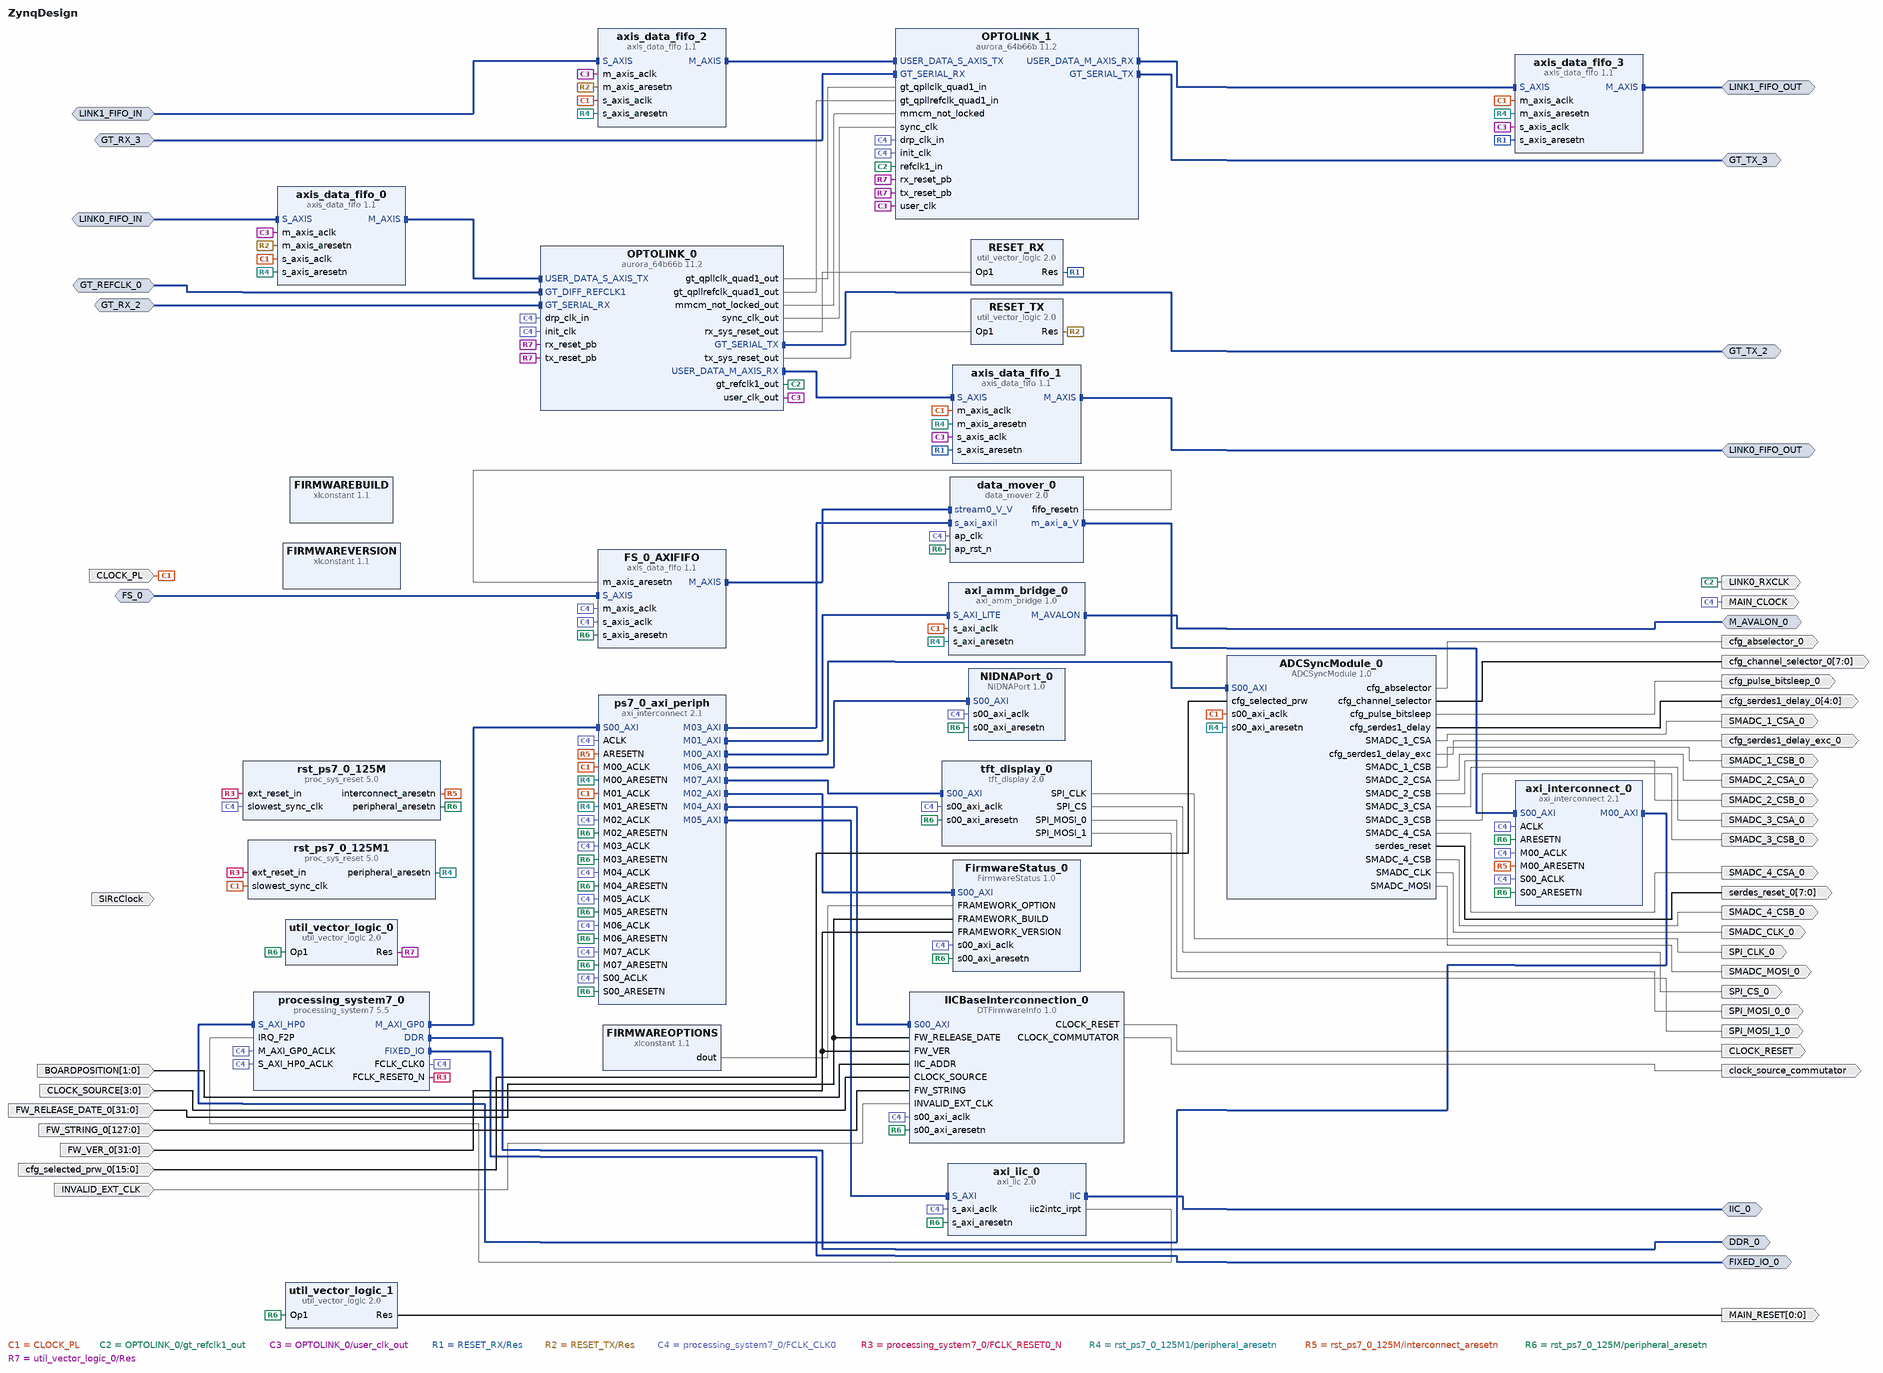
[diagram p0: block diagram of the top level]
# Vivado block design ZynqDesign, xc7z030fbg676-2, Vivado 2017.4
create_bd_design ZynqDesign

create_bd_intf_port -mode Master -vlnv xilinx.com:interface:ddrx_rtl:1.0 DDR_0
create_bd_intf_port -mode Master -vlnv xilinx.com:display_processing_system7:fixedio_rtl:1.0 FIXED_IO_0
create_bd_intf_port -mode Slave -vlnv xilinx.com:interface:axis_rtl:1.0 FS_0
set_property -dict [list \
  CONFIG.TDATA_NUM_BYTES 8 \
  CONFIG.TDEST_WIDTH 0 \
  CONFIG.TID_WIDTH 0 \
  CONFIG.TUSER_WIDTH 0 \
  CONFIG.HAS_TREADY 1 \
  CONFIG.HAS_TSTRB 0 \
  CONFIG.HAS_TKEEP 0 \
  CONFIG.HAS_TLAST 0 \
  CONFIG.FREQ_HZ 125000000 \
  CONFIG.LAYERED_METADATA {xilinx.com:interface:datatypes:1.0 {TDATA {datatype {name {attribs {resolve_type immediate dependency {} format string minimum {} maximum {}} value {}} bitwidth {attribs {resolve_type immediate dependency {} format long minimum {} maximum {}} value 64} bitoffset {attribs {resolve_type immediate dependency {} format long minimum {} maximum {}} value 0} integer {signed {attribs {resolve_type immediate dependency {} format bool minimum {} maximum {}} value false}}}}}} \
] [get_bd_intf_ports FS_0]
create_bd_intf_port -mode Slave -vlnv xilinx.com:interface:diff_clock_rtl:1.0 GT_REFCLK_0
set_property -dict {CONFIG.FREQ_HZ 156250000} [get_bd_intf_ports GT_REFCLK_0]
create_bd_intf_port -mode Slave -vlnv xilinx.com:display_aurora:GT_Serial_Transceiver_Pins_RX_rtl:1.0 GT_RX_2
create_bd_intf_port -mode Slave -vlnv xilinx.com:display_aurora:GT_Serial_Transceiver_Pins_RX_rtl:1.0 GT_RX_3
create_bd_intf_port -mode Master -vlnv xilinx.com:display_aurora:GT_Serial_Transceiver_Pins_TX_rtl:1.0 GT_TX_2
create_bd_intf_port -mode Master -vlnv xilinx.com:display_aurora:GT_Serial_Transceiver_Pins_TX_rtl:1.0 GT_TX_3
create_bd_intf_port -mode Master -vlnv xilinx.com:interface:iic_rtl:1.0 IIC_0
create_bd_intf_port -mode Slave -vlnv xilinx.com:interface:axis_rtl:1.0 LINK0_FIFO_IN
set_property -dict [list \
  CONFIG.TDATA_NUM_BYTES 1 \
  CONFIG.TDEST_WIDTH 0 \
  CONFIG.TID_WIDTH 0 \
  CONFIG.TUSER_WIDTH 0 \
  CONFIG.HAS_TREADY 1 \
  CONFIG.HAS_TSTRB 0 \
  CONFIG.HAS_TKEEP 0 \
  CONFIG.HAS_TLAST 0 \
  CONFIG.FREQ_HZ 125000000 \
  CONFIG.LAYERED_METADATA undef \
] [get_bd_intf_ports LINK0_FIFO_IN]
create_bd_intf_port -mode Master -vlnv xilinx.com:interface:axis_rtl:1.0 LINK0_FIFO_OUT
set_property -dict {CONFIG.FREQ_HZ 125000000} [get_bd_intf_ports LINK0_FIFO_OUT]
create_bd_intf_port -mode Slave -vlnv xilinx.com:interface:axis_rtl:1.0 LINK1_FIFO_IN
set_property -dict [list \
  CONFIG.TDATA_NUM_BYTES 1 \
  CONFIG.TDEST_WIDTH 0 \
  CONFIG.TID_WIDTH 0 \
  CONFIG.TUSER_WIDTH 0 \
  CONFIG.HAS_TREADY 1 \
  CONFIG.HAS_TSTRB 0 \
  CONFIG.HAS_TKEEP 0 \
  CONFIG.HAS_TLAST 0 \
  CONFIG.FREQ_HZ 125000000 \
  CONFIG.LAYERED_METADATA undef \
] [get_bd_intf_ports LINK1_FIFO_IN]
create_bd_intf_port -mode Master -vlnv xilinx.com:interface:axis_rtl:1.0 LINK1_FIFO_OUT
set_property -dict {CONFIG.FREQ_HZ 125000000} [get_bd_intf_ports LINK1_FIFO_OUT]
create_bd_intf_port -mode Master -vlnv xilinx.com:interface:avalon_rtl:1.0 M_AVALON_0
create_bd_port -dir I -from 1 -to 0 BOARDPOSITION
create_bd_port -dir I -type clk CLOCK_PL
set_property -dict [list \
  CONFIG.FREQ_HZ 125000000 \
  CONFIG.ASSOCIATED_BUSIF LINK0_FIFO_IN:LINK1_FIFO_IN:LINK1_FIFO_OUT:LINK0_FIFO_OUT \
] [get_bd_ports CLOCK_PL]
create_bd_port -dir O -type clk CLOCK_RESET
create_bd_port -dir I -from 3 -to 0 CLOCK_SOURCE
create_bd_port -dir I -from 31 -to 0 FW_RELEASE_DATE_0
create_bd_port -dir I -from 127 -to 0 FW_STRING_0
create_bd_port -dir I -from 31 -to 0 FW_VER_0
create_bd_port -dir I -type clk INVALID_EXT_CLK
set_property -dict {CONFIG.FREQ_HZ 125000000} [get_bd_ports INVALID_EXT_CLK]
create_bd_port -dir O -type clk LINK0_RXCLK
create_bd_port -dir O -type clk MAIN_CLOCK
create_bd_port -dir O -from 0 -to 0 MAIN_RESET
create_bd_port -dir I -type clk SIRcClock
set_property -dict {CONFIG.FREQ_HZ 156250000} [get_bd_ports SIRcClock]
create_bd_port -dir O SMADC_1_CSA_0
create_bd_port -dir O SMADC_1_CSB_0
create_bd_port -dir O SMADC_2_CSA_0
create_bd_port -dir O SMADC_2_CSB_0
create_bd_port -dir O SMADC_3_CSA_0
create_bd_port -dir O SMADC_3_CSB_0
create_bd_port -dir O SMADC_4_CSA_0
create_bd_port -dir O SMADC_4_CSB_0
create_bd_port -dir O -type clk SMADC_CLK_0
create_bd_port -dir O SMADC_MOSI_0
create_bd_port -dir O SPI_CLK_0
create_bd_port -dir O SPI_CS_0
create_bd_port -dir O SPI_MOSI_0_0
create_bd_port -dir O SPI_MOSI_1_0
create_bd_port -dir O cfg_abselector_0
create_bd_port -dir O -from 7 -to 0 cfg_channel_selector_0
create_bd_port -dir O cfg_pulse_bitsleep_0
create_bd_port -dir I -from 15 -to 0 cfg_selected_prw_0
create_bd_port -dir O -from 4 -to 0 cfg_serdes1_delay_0
create_bd_port -dir O cfg_serdes1_delay_exc_0
create_bd_port -dir O -type clk clock_source_commutator
create_bd_port -dir O -from 7 -to 0 -type rst serdes_reset_0

create_bd_cell -type ip -vlnv NuclearInstruments:user:ADCSyncModule:1.0 ADCSyncModule_0
create_bd_cell -type ip -vlnv xilinx.com:ip:xlconstant:1.1 FIRMWAREBUILD
set_property -dict {CONFIG.CONST_WIDTH 32 CONFIG.CONST_VAL 0x19031100} [get_bd_cells FIRMWAREBUILD]
create_bd_cell -type ip -vlnv xilinx.com:ip:xlconstant:1.1 FIRMWAREOPTIONS
set_property -dict {CONFIG.CONST_WIDTH 32} [get_bd_cells FIRMWAREOPTIONS]
create_bd_cell -type ip -vlnv xilinx.com:ip:xlconstant:1.1 FIRMWAREVERSION
set_property -dict {CONFIG.CONST_WIDTH 32} [get_bd_cells FIRMWAREVERSION]
create_bd_cell -type ip -vlnv xilinx.com:ip:axis_data_fifo:1.1 FS_0_AXIFIFO
set_property -dict {CONFIG.IS_ACLK_ASYNC 1} [get_bd_cells FS_0_AXIFIFO]
create_bd_cell -type ip -vlnv xilinx.com:user:FirmwareStatus:1.0 FirmwareStatus_0
create_bd_cell -type ip -vlnv NuclearInstruments:user:DTFirmwareInfo:1.0 IICBaseInterconnection_0
create_bd_cell -type ip -vlnv xilinx.com:user:NIDNAPort:1.0 NIDNAPort_0
create_bd_cell -type ip -vlnv xilinx.com:ip:aurora_64b66b:11.2 OPTOLINK_0
set_property -dict [list \
  CONFIG.C_LINE_RATE 6.25 \
  CONFIG.C_REFCLK_FREQUENCY 156.250 \
  CONFIG.dataflow_config TX/RX_Simplex \
  CONFIG.interface_mode Streaming \
  CONFIG.flow_mode None \
  CONFIG.C_USER_K false \
  CONFIG.SINGLEEND_INITCLK true \
  CONFIG.C_GT_LOC_3 X \
  CONFIG.C_GT_LOC_2 X \
  CONFIG.C_GT_LOC_1 1 \
  CONFIG.C_GT_CLOCK_1 GTXQ0 \
  CONFIG.drp_mode Disabled \
  CONFIG.SupportLevel 1 \
  CONFIG.TransceiverControl true \
  CONFIG.C_USE_BYTESWAP false \
] [get_bd_cells OPTOLINK_0]
create_bd_cell -type ip -vlnv xilinx.com:ip:aurora_64b66b:11.2 OPTOLINK_1
set_property -dict [list \
  CONFIG.C_LINE_RATE 6.25 \
  CONFIG.C_REFCLK_FREQUENCY 156.250 \
  CONFIG.dataflow_config TX/RX_Simplex \
  CONFIG.interface_mode Streaming \
  CONFIG.flow_mode None \
  CONFIG.C_USER_K false \
  CONFIG.C_GT_LOC_4 X \
  CONFIG.C_GT_LOC_2 X \
  CONFIG.C_GT_LOC_1 1 \
  CONFIG.C_GT_CLOCK_1 GTXQ0 \
  CONFIG.drp_mode Disabled \
  CONFIG.SupportLevel 0 \
  CONFIG.TransceiverControl true \
] [get_bd_cells OPTOLINK_1]
create_bd_cell -type ip -vlnv xilinx.com:ip:util_vector_logic:2.0 RESET_RX
set_property -dict {CONFIG.C_SIZE 1 CONFIG.C_OPERATION not} [get_bd_cells RESET_RX]
create_bd_cell -type ip -vlnv xilinx.com:ip:util_vector_logic:2.0 RESET_TX
set_property -dict {CONFIG.C_SIZE 1 CONFIG.C_OPERATION not} [get_bd_cells RESET_TX]
create_bd_cell -type ip -vlnv xilinx.com:ip:axi_amm_bridge:1.0 axi_amm_bridge_0
set_property -dict [list \
  CONFIG.C_PROTOCOL 0 \
  CONFIG.C_HAS_WAIT_REQUEST 1 \
  CONFIG.C_BURST_SUPPORT 0 \
  CONFIG.C_ADDRESS_MODE 1 \
  CONFIG.C_USE_BYTEENABLE 0 \
  CONFIG.C_AVM_BURST_WIDTH 1 \
  CONFIG.C_HAS_RESPONSE 0 \
] [get_bd_cells axi_amm_bridge_0]
create_bd_cell -type ip -vlnv xilinx.com:ip:axi_iic:2.0 axi_iic_0
set_property -dict {CONFIG.C_SCL_INERTIAL_DELAY 5 CONFIG.C_SDA_INERTIAL_DELAY 5 CONFIG.IIC_FREQ_KHZ 100} [get_bd_cells axi_iic_0]
create_bd_cell -type ip -vlnv xilinx.com:ip:axi_interconnect:2.1 axi_interconnect_0
set_property -dict {CONFIG.NUM_MI 1} [get_bd_cells axi_interconnect_0]
create_bd_cell -type ip -vlnv xilinx.com:ip:axis_data_fifo:1.1 axis_data_fifo_0
set_property -dict {CONFIG.TDATA_NUM_BYTES 8 CONFIG.IS_ACLK_ASYNC 1} [get_bd_cells axis_data_fifo_0]
create_bd_cell -type ip -vlnv xilinx.com:ip:axis_data_fifo:1.1 axis_data_fifo_1
set_property -dict {CONFIG.IS_ACLK_ASYNC 1} [get_bd_cells axis_data_fifo_1]
create_bd_cell -type ip -vlnv xilinx.com:ip:axis_data_fifo:1.1 axis_data_fifo_2
set_property -dict {CONFIG.TDATA_NUM_BYTES 8 CONFIG.IS_ACLK_ASYNC 1} [get_bd_cells axis_data_fifo_2]
create_bd_cell -type ip -vlnv xilinx.com:ip:axis_data_fifo:1.1 axis_data_fifo_3
set_property -dict {CONFIG.IS_ACLK_ASYNC 1} [get_bd_cells axis_data_fifo_3]
create_bd_cell -type ip -vlnv NuclearInstruments:hls:data_mover:2.0 data_mover_0
create_bd_cell -type ip -vlnv xilinx.com:ip:processing_system7:5.5 processing_system7_0
set_property -dict [list \
  CONFIG.PCW_UIPARAM_DDR_FREQ_MHZ 533.333333 \
  CONFIG.PCW_CPU_CPU_6X4X_MAX_RANGE 800 \
  CONFIG.PCW_APU_PERIPHERAL_FREQMHZ 666.666666 \
  CONFIG.PCW_SDIO_PERIPHERAL_FREQMHZ 50 \
  CONFIG.PCW_UART_PERIPHERAL_FREQMHZ 50 \
  CONFIG.PCW_I2C_PERIPHERAL_FREQMHZ 111.111115 \
  CONFIG.PCW_FPGA0_PERIPHERAL_FREQMHZ 125 \
  CONFIG.PCW_FPGA1_PERIPHERAL_FREQMHZ 100 \
  CONFIG.PCW_FPGA2_PERIPHERAL_FREQMHZ 33.333333 \
  CONFIG.PCW_USE_S_AXI_HP0 1 \
  CONFIG.PCW_USE_FABRIC_INTERRUPT 1 \
  CONFIG.PCW_IRQ_F2P_INTR 1 \
  CONFIG.PCW_GP0_EN_MODIFIABLE_TXN 0 \
  CONFIG.PCW_GP1_EN_MODIFIABLE_TXN 0 \
  CONFIG.PCW_PERIPHERAL_BOARD_PRESET None \
  CONFIG.PCW_PRESET_BANK1_VOLTAGE {LVCMOS 1.8V} \
  CONFIG.PCW_UIPARAM_DDR_PARTNO {MT41K256M16 RE-125} \
  CONFIG.PCW_QSPI_PERIPHERAL_ENABLE 1 \
  CONFIG.PCW_QSPI_QSPI_IO {MIO 1 .. 6} \
  CONFIG.PCW_QSPI_GRP_SINGLE_SS_ENABLE 1 \
  CONFIG.PCW_QSPI_GRP_SINGLE_SS_IO {MIO 1 .. 6} \
  CONFIG.PCW_SINGLE_QSPI_DATA_MODE x4 \
  CONFIG.PCW_QSPI_GRP_FBCLK_ENABLE 1 \
  CONFIG.PCW_QSPI_GRP_FBCLK_IO {MIO 8} \
  CONFIG.PCW_ENET0_PERIPHERAL_ENABLE 1 \
  CONFIG.PCW_ENET0_ENET0_IO {MIO 16 .. 27} \
  CONFIG.PCW_ENET0_GRP_MDIO_ENABLE 1 \
  CONFIG.PCW_ENET0_GRP_MDIO_IO {MIO 52 .. 53} \
  CONFIG.PCW_ENET_RESET_ENABLE 1 \
  CONFIG.PCW_ENET_RESET_SELECT {Share reset pin} \
  CONFIG.PCW_ENET0_RESET_ENABLE 1 \
  CONFIG.PCW_ENET0_RESET_IO {MIO 0} \
  CONFIG.PCW_SD0_PERIPHERAL_ENABLE 1 \
  CONFIG.PCW_SD0_SD0_IO {MIO 40 .. 45} \
  CONFIG.PCW_SD0_GRP_CD_ENABLE 0 \
  CONFIG.PCW_SD0_GRP_WP_ENABLE 1 \
  CONFIG.PCW_SD0_GRP_WP_IO {MIO 50} \
  CONFIG.PCW_UART0_PERIPHERAL_ENABLE 1 \
  CONFIG.PCW_UART0_UART0_IO {MIO 46 .. 47} \
  CONFIG.PCW_UART1_PERIPHERAL_ENABLE 1 \
  CONFIG.PCW_UART1_UART1_IO {MIO 48 .. 49} \
  CONFIG.PCW_TTC0_PERIPHERAL_ENABLE 1 \
  CONFIG.PCW_TTC0_TTC0_IO EMIO \
  CONFIG.PCW_USB0_PERIPHERAL_ENABLE 1 \
  CONFIG.PCW_USB0_USB0_IO {MIO 28 .. 39} \
  CONFIG.PCW_USB_RESET_ENABLE 1 \
  CONFIG.PCW_USB_RESET_SELECT {Share reset pin} \
  CONFIG.PCW_USB0_RESET_ENABLE 1 \
  CONFIG.PCW_USB0_RESET_IO {MIO 7} \
  CONFIG.PCW_I2C0_PERIPHERAL_ENABLE 1 \
  CONFIG.PCW_I2C0_I2C0_IO {MIO 10 .. 11} \
  CONFIG.PCW_I2C0_GRP_INT_ENABLE 0 \
  CONFIG.PCW_I2C_RESET_ENABLE 1 \
  CONFIG.PCW_I2C_RESET_SELECT {Share reset pin} \
  CONFIG.PCW_GPIO_PERIPHERAL_ENABLE 1 \
  CONFIG.PCW_GPIO_MIO_GPIO_ENABLE 1 \
  CONFIG.PCW_GPIO_MIO_GPIO_IO MIO \
] [get_bd_cells processing_system7_0]
# 514 more settings of processing_system7_0 are not shown: defaults, MIO pin electricals, DDR timing, and values the tool derives
create_bd_cell -type ip -vlnv xilinx.com:ip:axi_interconnect:2.1 ps7_0_axi_periph
set_property -dict {CONFIG.NUM_MI 8} [get_bd_cells ps7_0_axi_periph]
create_bd_cell -type ip -vlnv xilinx.com:ip:proc_sys_reset:5.0 rst_ps7_0_125M
create_bd_cell -type ip -vlnv xilinx.com:ip:proc_sys_reset:5.0 rst_ps7_0_125M1
create_bd_cell -type ip -vlnv xilinx.com:user:tft_display:2.0 tft_display_0
create_bd_cell -type ip -vlnv xilinx.com:ip:util_vector_logic:2.0 util_vector_logic_0
set_property -dict {CONFIG.C_SIZE 1 CONFIG.C_OPERATION not} [get_bd_cells util_vector_logic_0]
create_bd_cell -type ip -vlnv xilinx.com:ip:util_vector_logic:2.0 util_vector_logic_1
set_property -dict {CONFIG.C_SIZE 1 CONFIG.C_OPERATION not} [get_bd_cells util_vector_logic_1]

# ---- connections ----

connect_bd_intf_net -intf_net HLINK_0_USER_DATA_M_AXIS_RX [get_bd_intf_pins OPTOLINK_0/USER_DATA_M_AXIS_RX] [get_bd_intf_pins axis_data_fifo_1/S_AXIS]
connect_bd_intf_net -intf_net HLINK_1_USER_DATA_M_AXIS_RX [get_bd_intf_pins OPTOLINK_1/USER_DATA_M_AXIS_RX] [get_bd_intf_pins axis_data_fifo_3/S_AXIS]
connect_bd_intf_net [get_bd_intf_pins axi_interconnect_0/M00_AXI] [get_bd_intf_pins processing_system7_0/S_AXI_HP0]
connect_bd_intf_net [get_bd_intf_pins OPTOLINK_0/USER_DATA_S_AXIS_TX] [get_bd_intf_pins axis_data_fifo_0/M_AXIS]
connect_bd_intf_net [get_bd_intf_pins OPTOLINK_1/USER_DATA_S_AXIS_TX] [get_bd_intf_pins axis_data_fifo_2/M_AXIS]
connect_bd_intf_net -intf_net axis_data_fifo_4_M_AXIS [get_bd_intf_pins FS_0_AXIFIFO/M_AXIS] [get_bd_intf_pins data_mover_0/stream0_V_V]
connect_bd_intf_net [get_bd_intf_pins axi_interconnect_0/S00_AXI] [get_bd_intf_pins data_mover_0/m_axi_a_V]
connect_bd_intf_net [get_bd_intf_pins processing_system7_0/M_AXI_GP0] [get_bd_intf_pins ps7_0_axi_periph/S00_AXI]
connect_bd_intf_net [get_bd_intf_pins ADCSyncModule_0/S00_AXI] [get_bd_intf_pins ps7_0_axi_periph/M00_AXI]
connect_bd_intf_net [get_bd_intf_pins axi_amm_bridge_0/S_AXI_LITE] [get_bd_intf_pins ps7_0_axi_periph/M01_AXI]
connect_bd_intf_net [get_bd_intf_pins FirmwareStatus_0/S00_AXI] [get_bd_intf_pins ps7_0_axi_periph/M02_AXI]
connect_bd_intf_net [get_bd_intf_pins data_mover_0/s_axi_axil] [get_bd_intf_pins ps7_0_axi_periph/M03_AXI]
connect_bd_intf_net [get_bd_intf_pins IICBaseInterconnection_0/S00_AXI] [get_bd_intf_pins ps7_0_axi_periph/M04_AXI]
connect_bd_intf_net [get_bd_intf_pins axi_iic_0/S_AXI] [get_bd_intf_pins ps7_0_axi_periph/M05_AXI]
connect_bd_intf_net [get_bd_intf_pins NIDNAPort_0/S00_AXI] [get_bd_intf_pins ps7_0_axi_periph/M06_AXI]
connect_bd_intf_net [get_bd_intf_pins ps7_0_axi_periph/M07_AXI] [get_bd_intf_pins tft_display_0/S00_AXI]
connect_bd_intf_net [get_bd_intf_ports DDR_0] [get_bd_intf_pins processing_system7_0/DDR]
connect_bd_intf_net [get_bd_intf_ports FIXED_IO_0] [get_bd_intf_pins processing_system7_0/FIXED_IO]
connect_bd_intf_net -intf_net FS_0_1 [get_bd_intf_ports FS_0] [get_bd_intf_pins FS_0_AXIFIFO/S_AXIS]
connect_bd_intf_net -intf_net GT_REFCLK_0_1 [get_bd_intf_ports GT_REFCLK_0] [get_bd_intf_pins OPTOLINK_0/GT_DIFF_REFCLK1]
connect_bd_intf_net -intf_net GT_SERIAL_RX_1_2 [get_bd_intf_ports GT_RX_2] [get_bd_intf_pins OPTOLINK_0/GT_SERIAL_RX]
connect_bd_intf_net -intf_net GT_SERIAL_RX_0_2 [get_bd_intf_ports GT_RX_3] [get_bd_intf_pins OPTOLINK_1/GT_SERIAL_RX]
connect_bd_intf_net -intf_net HLINK_0_GT_SERIAL_TX [get_bd_intf_ports GT_TX_2] [get_bd_intf_pins OPTOLINK_0/GT_SERIAL_TX]
connect_bd_intf_net -intf_net HLINK_1_GT_SERIAL_TX [get_bd_intf_ports GT_TX_3] [get_bd_intf_pins OPTOLINK_1/GT_SERIAL_TX]
connect_bd_intf_net [get_bd_intf_ports IIC_0] [get_bd_intf_pins axi_iic_0/IIC]
connect_bd_intf_net -intf_net S_AXIS_0_1 [get_bd_intf_ports LINK0_FIFO_IN] [get_bd_intf_pins axis_data_fifo_0/S_AXIS]
connect_bd_intf_net [get_bd_intf_ports LINK0_FIFO_OUT] [get_bd_intf_pins axis_data_fifo_1/M_AXIS]
connect_bd_intf_net -intf_net S_AXIS_0_2 [get_bd_intf_ports LINK1_FIFO_IN] [get_bd_intf_pins axis_data_fifo_2/S_AXIS]
connect_bd_intf_net [get_bd_intf_ports LINK1_FIFO_OUT] [get_bd_intf_pins axis_data_fifo_3/M_AXIS]
connect_bd_intf_net [get_bd_intf_ports M_AVALON_0] [get_bd_intf_pins axi_amm_bridge_0/M_AVALON]
connect_bd_net [get_bd_pins ADCSyncModule_0/SMADC_1_CSA] [get_bd_ports SMADC_1_CSA_0]
connect_bd_net [get_bd_pins ADCSyncModule_0/SMADC_1_CSB] [get_bd_ports SMADC_1_CSB_0]
connect_bd_net [get_bd_pins ADCSyncModule_0/SMADC_2_CSA] [get_bd_ports SMADC_2_CSA_0]
connect_bd_net [get_bd_pins ADCSyncModule_0/SMADC_2_CSB] [get_bd_ports SMADC_2_CSB_0]
connect_bd_net [get_bd_pins ADCSyncModule_0/SMADC_3_CSA] [get_bd_ports SMADC_3_CSA_0]
connect_bd_net [get_bd_pins ADCSyncModule_0/SMADC_3_CSB] [get_bd_ports SMADC_3_CSB_0]
connect_bd_net [get_bd_pins ADCSyncModule_0/SMADC_4_CSA] [get_bd_ports SMADC_4_CSA_0]
connect_bd_net [get_bd_pins ADCSyncModule_0/SMADC_4_CSB] [get_bd_ports SMADC_4_CSB_0]
connect_bd_net [get_bd_pins ADCSyncModule_0/SMADC_CLK] [get_bd_ports SMADC_CLK_0]
connect_bd_net [get_bd_pins ADCSyncModule_0/SMADC_MOSI] [get_bd_ports SMADC_MOSI_0]
connect_bd_net [get_bd_pins ADCSyncModule_0/cfg_abselector] [get_bd_ports cfg_abselector_0]
connect_bd_net [get_bd_pins ADCSyncModule_0/cfg_channel_selector] [get_bd_ports cfg_channel_selector_0]
connect_bd_net [get_bd_pins ADCSyncModule_0/cfg_pulse_bitsleep] [get_bd_ports cfg_pulse_bitsleep_0]
connect_bd_net [get_bd_pins ADCSyncModule_0/cfg_serdes1_delay] [get_bd_ports cfg_serdes1_delay_0]
connect_bd_net [get_bd_pins ADCSyncModule_0/cfg_serdes1_delay_exc] [get_bd_ports cfg_serdes1_delay_exc_0]
connect_bd_net [get_bd_pins ADCSyncModule_0/serdes_reset] [get_bd_ports serdes_reset_0]
connect_bd_net [get_bd_ports BOARDPOSITION] [get_bd_pins IICBaseInterconnection_0/IIC_ADDR]
connect_bd_net [get_bd_ports CLOCK_PL] \
  [get_bd_pins ADCSyncModule_0/s00_axi_aclk] [get_bd_pins axi_amm_bridge_0/s_axi_aclk] \
  [get_bd_pins axis_data_fifo_0/s_axis_aclk] [get_bd_pins axis_data_fifo_1/m_axis_aclk] \
  [get_bd_pins axis_data_fifo_2/s_axis_aclk] [get_bd_pins axis_data_fifo_3/m_axis_aclk] \
  [get_bd_pins ps7_0_axi_periph/M00_ACLK] [get_bd_pins ps7_0_axi_periph/M01_ACLK] \
  [get_bd_pins rst_ps7_0_125M1/slowest_sync_clk]
connect_bd_net [get_bd_ports CLOCK_SOURCE] [get_bd_pins IICBaseInterconnection_0/CLOCK_SOURCE]
connect_bd_net -net FIRMWAREBUILD1_dout [get_bd_pins FIRMWAREOPTIONS/dout] [get_bd_pins FirmwareStatus_0/FRAMEWORK_OPTION]
connect_bd_net -net FW_RELEASE_DATE_0_1 [get_bd_ports FW_RELEASE_DATE_0] \
  [get_bd_pins FirmwareStatus_0/FRAMEWORK_BUILD] [get_bd_pins IICBaseInterconnection_0/FW_RELEASE_DATE]
connect_bd_net -net FW_STRING_0_1 [get_bd_ports FW_STRING_0] [get_bd_pins IICBaseInterconnection_0/FW_STRING]
connect_bd_net -net FW_VER_0_1 [get_bd_ports FW_VER_0] [get_bd_pins FirmwareStatus_0/FRAMEWORK_VERSION] [get_bd_pins IICBaseInterconnection_0/FW_VER]
connect_bd_net -net HLINK_0_gt_qpllclk_quad1_out [get_bd_pins OPTOLINK_0/gt_qpllclk_quad1_out] [get_bd_pins OPTOLINK_1/gt_qpllclk_quad1_in]
connect_bd_net -net HLINK_0_gt_qpllrefclk_quad1_out [get_bd_pins OPTOLINK_0/gt_qpllrefclk_quad1_out] [get_bd_pins OPTOLINK_1/gt_qpllrefclk_quad1_in]
connect_bd_net -net HLINK_0_gt_refclk1_out [get_bd_pins OPTOLINK_0/gt_refclk1_out] [get_bd_ports LINK0_RXCLK] [get_bd_pins OPTOLINK_1/refclk1_in]
connect_bd_net -net HLINK_0_mmcm_not_locked_out [get_bd_pins OPTOLINK_0/mmcm_not_locked_out] [get_bd_pins OPTOLINK_1/mmcm_not_locked]
connect_bd_net -net HLINK_0_rx_sys_reset_out [get_bd_pins OPTOLINK_0/rx_sys_reset_out] [get_bd_pins RESET_RX/Op1]
connect_bd_net -net HLINK_0_sync_clk_out [get_bd_pins OPTOLINK_0/sync_clk_out] [get_bd_pins OPTOLINK_1/sync_clk]
connect_bd_net -net HLINK_0_tx_sys_reset_out [get_bd_pins OPTOLINK_0/tx_sys_reset_out] [get_bd_pins RESET_TX/Op1]
connect_bd_net -net HLINK_0_user_clk_out [get_bd_pins OPTOLINK_0/user_clk_out] \
  [get_bd_pins OPTOLINK_1/user_clk] [get_bd_pins axis_data_fifo_0/m_axis_aclk] [get_bd_pins axis_data_fifo_1/s_axis_aclk] \
  [get_bd_pins axis_data_fifo_2/m_axis_aclk] [get_bd_pins axis_data_fifo_3/s_axis_aclk]
connect_bd_net [get_bd_pins IICBaseInterconnection_0/CLOCK_COMMUTATOR] [get_bd_ports clock_source_commutator]
connect_bd_net [get_bd_pins IICBaseInterconnection_0/CLOCK_RESET] [get_bd_ports CLOCK_RESET]
connect_bd_net [get_bd_ports INVALID_EXT_CLK] [get_bd_pins IICBaseInterconnection_0/INVALID_EXT_CLK]
connect_bd_net [get_bd_pins RESET_RX/Res] [get_bd_pins axis_data_fifo_1/s_axis_aresetn] [get_bd_pins axis_data_fifo_3/s_axis_aresetn]
connect_bd_net [get_bd_pins RESET_TX/Res] [get_bd_pins axis_data_fifo_0/m_axis_aresetn] [get_bd_pins axis_data_fifo_2/m_axis_aresetn]
connect_bd_net [get_bd_pins axi_iic_0/iic2intc_irpt] [get_bd_pins processing_system7_0/IRQ_F2P]
connect_bd_net -net cfg_selected_prw_0_1 [get_bd_ports cfg_selected_prw_0] [get_bd_pins ADCSyncModule_0/cfg_selected_prw]
connect_bd_net [get_bd_pins data_mover_0/fifo_resetn] [get_bd_pins FS_0_AXIFIFO/m_axis_aresetn]
connect_bd_net [get_bd_pins processing_system7_0/FCLK_CLK0] \
  [get_bd_ports MAIN_CLOCK] [get_bd_pins FS_0_AXIFIFO/m_axis_aclk] [get_bd_pins FS_0_AXIFIFO/s_axis_aclk] \
  [get_bd_pins FirmwareStatus_0/s00_axi_aclk] [get_bd_pins IICBaseInterconnection_0/s00_axi_aclk] \
  [get_bd_pins NIDNAPort_0/s00_axi_aclk] [get_bd_pins OPTOLINK_0/drp_clk_in] [get_bd_pins OPTOLINK_0/init_clk] \
  [get_bd_pins OPTOLINK_1/drp_clk_in] [get_bd_pins OPTOLINK_1/init_clk] [get_bd_pins axi_iic_0/s_axi_aclk] \
  [get_bd_pins axi_interconnect_0/ACLK] [get_bd_pins axi_interconnect_0/M00_ACLK] [get_bd_pins axi_interconnect_0/S00_ACLK] \
  [get_bd_pins data_mover_0/ap_clk] [get_bd_pins processing_system7_0/M_AXI_GP0_ACLK] \
  [get_bd_pins processing_system7_0/S_AXI_HP0_ACLK] [get_bd_pins ps7_0_axi_periph/ACLK] \
  [get_bd_pins ps7_0_axi_periph/M02_ACLK] [get_bd_pins ps7_0_axi_periph/M03_ACLK] [get_bd_pins ps7_0_axi_periph/M04_ACLK] \
  [get_bd_pins ps7_0_axi_periph/M05_ACLK] [get_bd_pins ps7_0_axi_periph/M06_ACLK] [get_bd_pins ps7_0_axi_periph/M07_ACLK] \
  [get_bd_pins ps7_0_axi_periph/S00_ACLK] [get_bd_pins rst_ps7_0_125M/slowest_sync_clk] \
  [get_bd_pins tft_display_0/s00_axi_aclk]
connect_bd_net [get_bd_pins processing_system7_0/FCLK_RESET0_N] [get_bd_pins rst_ps7_0_125M/ext_reset_in] [get_bd_pins rst_ps7_0_125M1/ext_reset_in]
connect_bd_net [get_bd_pins rst_ps7_0_125M1/peripheral_aresetn] \
  [get_bd_pins ADCSyncModule_0/s00_axi_aresetn] [get_bd_pins axi_amm_bridge_0/s_axi_aresetn] \
  [get_bd_pins axis_data_fifo_0/s_axis_aresetn] [get_bd_pins axis_data_fifo_1/m_axis_aresetn] \
  [get_bd_pins axis_data_fifo_2/s_axis_aresetn] [get_bd_pins axis_data_fifo_3/m_axis_aresetn] \
  [get_bd_pins ps7_0_axi_periph/M00_ARESETN] [get_bd_pins ps7_0_axi_periph/M01_ARESETN]
connect_bd_net [get_bd_pins rst_ps7_0_125M/interconnect_aresetn] [get_bd_pins axi_interconnect_0/M00_ARESETN] [get_bd_pins ps7_0_axi_periph/ARESETN]
connect_bd_net [get_bd_pins rst_ps7_0_125M/peripheral_aresetn] \
  [get_bd_pins FS_0_AXIFIFO/s_axis_aresetn] [get_bd_pins FirmwareStatus_0/s00_axi_aresetn] \
  [get_bd_pins IICBaseInterconnection_0/s00_axi_aresetn] [get_bd_pins NIDNAPort_0/s00_axi_aresetn] \
  [get_bd_pins axi_iic_0/s_axi_aresetn] [get_bd_pins axi_interconnect_0/ARESETN] [get_bd_pins axi_interconnect_0/S00_ARESETN] \
  [get_bd_pins data_mover_0/ap_rst_n] [get_bd_pins ps7_0_axi_periph/M02_ARESETN] [get_bd_pins ps7_0_axi_periph/M03_ARESETN] \
  [get_bd_pins ps7_0_axi_periph/M04_ARESETN] [get_bd_pins ps7_0_axi_periph/M05_ARESETN] \
  [get_bd_pins ps7_0_axi_periph/M06_ARESETN] [get_bd_pins ps7_0_axi_periph/M07_ARESETN] \
  [get_bd_pins ps7_0_axi_periph/S00_ARESETN] [get_bd_pins tft_display_0/s00_axi_aresetn] \
  [get_bd_pins util_vector_logic_0/Op1] [get_bd_pins util_vector_logic_1/Op1]
connect_bd_net [get_bd_pins tft_display_0/SPI_CLK] [get_bd_ports SPI_CLK_0]
connect_bd_net [get_bd_pins tft_display_0/SPI_CS] [get_bd_ports SPI_CS_0]
connect_bd_net [get_bd_pins tft_display_0/SPI_MOSI_0] [get_bd_ports SPI_MOSI_0_0]
connect_bd_net [get_bd_pins tft_display_0/SPI_MOSI_1] [get_bd_ports SPI_MOSI_1_0]
connect_bd_net [get_bd_pins util_vector_logic_0/Res] \
  [get_bd_pins OPTOLINK_0/rx_reset_pb] [get_bd_pins OPTOLINK_0/tx_reset_pb] [get_bd_pins OPTOLINK_1/rx_reset_pb] \
  [get_bd_pins OPTOLINK_1/tx_reset_pb]
connect_bd_net [get_bd_pins util_vector_logic_1/Res] [get_bd_ports MAIN_RESET]

# ---- address map ----
assign_bd_address -offset 0x00000000 -range 1G -target_address_space [get_bd_addr_spaces data_mover_0/Data_m_axi_a_V] [get_bd_addr_segs processing_system7_0/S_AXI_HP0/HP0_DDR_LOWOCM]
assign_bd_address -offset 0x41600000 -range 64K -target_address_space [get_bd_addr_spaces processing_system7_0/Data] [get_bd_addr_segs axi_iic_0/S_AXI/Reg]
assign_bd_address -offset 0x43C00000 -range 64K -target_address_space [get_bd_addr_spaces processing_system7_0/Data] [get_bd_addr_segs FirmwareStatus_0/S00_AXI/S00_AXI_reg]
assign_bd_address -offset 0x43C10000 -range 64K -target_address_space [get_bd_addr_spaces processing_system7_0/Data] [get_bd_addr_segs data_mover_0/s_axi_axil/Reg]
assign_bd_address -offset 0x43C20000 -range 64K -target_address_space [get_bd_addr_spaces processing_system7_0/Data] [get_bd_addr_segs IICBaseInterconnection_0/S00_AXI/S00_AXI_reg]
assign_bd_address -offset 0x43C30000 -range 64K -target_address_space [get_bd_addr_spaces processing_system7_0/Data] [get_bd_addr_segs NIDNAPort_0/S00_AXI/S00_AXI_reg]
assign_bd_address -offset 0x43C40000 -range 64K -target_address_space [get_bd_addr_spaces processing_system7_0/Data] [get_bd_addr_segs tft_display_0/S00_AXI/S00_AXI_reg]
assign_bd_address -offset 0x4FFF0000 -range 64K -target_address_space [get_bd_addr_spaces processing_system7_0/Data] [get_bd_addr_segs ADCSyncModule_0/S00_AXI/S00_AXI_reg]
assign_bd_address -offset 0x50000000 -range 256M -target_address_space [get_bd_addr_spaces processing_system7_0/Data] [get_bd_addr_segs M_AVALON_0/Reg]

validate_bd_design
save_bd_design
